# EAGLE design arduino_uno_pcb _with_lcd (EAGLE 6.1)
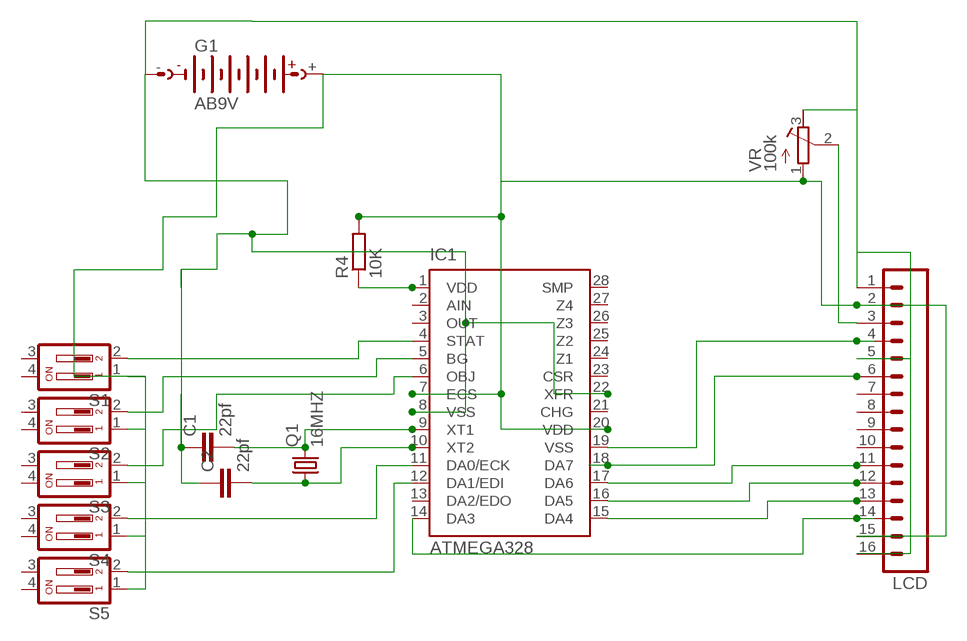
[diagram p0: schematic, sheet 1]

## Parts
C1  22pf  C2.5/2  [C2.5-2]
C2  22pf  C2.5/2  [C2.5-2]
G1  AB9V  [AB9V]
IC1  ATMEGA328  QT9701BD  [DIL28-3]
LCD  M16  [16P]
Q1  16MHZ  CRYSTALHC49S  [HC49/S]
R4  10K  R-EU_0207/10  [0207/10]
S1  DP02  [DP-02]
S2  DP02  [DP-02]
S3  DP02  [DP-02]
S4  DP02  [DP-02]
S5  DP02  [DP-02]
VR  100k  R-TRIMM64P  [RTRIM64P]

## Nets
N$1: C1.2 IC1.9(XT1) Q1.2
N$2: C2.2 IC1.10(XT2) Q1.1
N$3: G1.+ IC1.7(ECS) IC1.20(VDD) LCD.2 LCD.15 R4.2 S1.1 S2.1 S3.1 S4.1 S5.1 VR.1(E)
N$4: IC1.11(DA0/ECK) S4.2
N$5: IC1.4(STAT) S1.2
N$7: IC1.5(BG) S2.2
N$8: IC1.6(OBJ) S3.2
N$9: IC1.12(DA1/EDI) S5.2
N$22: LCD.3 VR.2(S)
N$23: IC1.19(VSS) LCD.4
N$24: IC1.18(DA7) LCD.6
N$25: IC1.17(DA6) LCD.11
N$26: IC1.16(DA5) LCD.12
N$27: IC1.15(DA4) LCD.13
N$28: C1.1 C2.1 G1.- IC1.8(VSS) IC1.22(XFR) LCD.1 LCD.5 LCD.16 VR.3(A)
N$29: IC1.14(DA3) LCD.14
N$31: IC1.1(VDD) R4.1
Unconnected: IC1.2(AIN) IC1.3(OUT) IC1.13(DA2/EDO) IC1.21(CHG) IC1.23(CSR) IC1.24(Z1) IC1.25(Z2) IC1.26(Z3) IC1.27(Z4) IC1.28(SMP) LCD.7 LCD.8 LCD.9 LCD.10 S1.3 S1.4 S2.3 S2.4 S3.3 S3.4 S4.3 S4.4 S5.3 S5.4

## Library data of the parts
C1 C2 = capacitor-wima:C: CAPACITOR naming: grid - package width
G1 = battery:AB9V: 9-V BATTERY CLIP
IC1 = quantum-research-group:QT9701B: Charge-Transfer Capacitance Sensor IC Source: http://data.qprox.com/downloads/datasheets/qt9701b.pdf; OC_FARNELL: unknown; OC_NEWARK: unknown
LCD = con-amp-quick:M16: AMP QUICK CONNECTOR; OC_FARNELL: unknown; OC_NEWARK: unknown
Q1 = crystal:CRYSTAL: CRYSTAL; OC_FARNELL: 1667008; OC_NEWARK: unknown
R4 = rcl:R-EU_: RESISTOR, European symbol
S1-S5 = switch-dil:DP02: DIL/CODE SWITCH; MPN: MCDP02; OC_FARNELL: 1255233; OC_NEWARK: 26M1095
VR = resistor:R-TRIMM: Trimm resistor

## Board
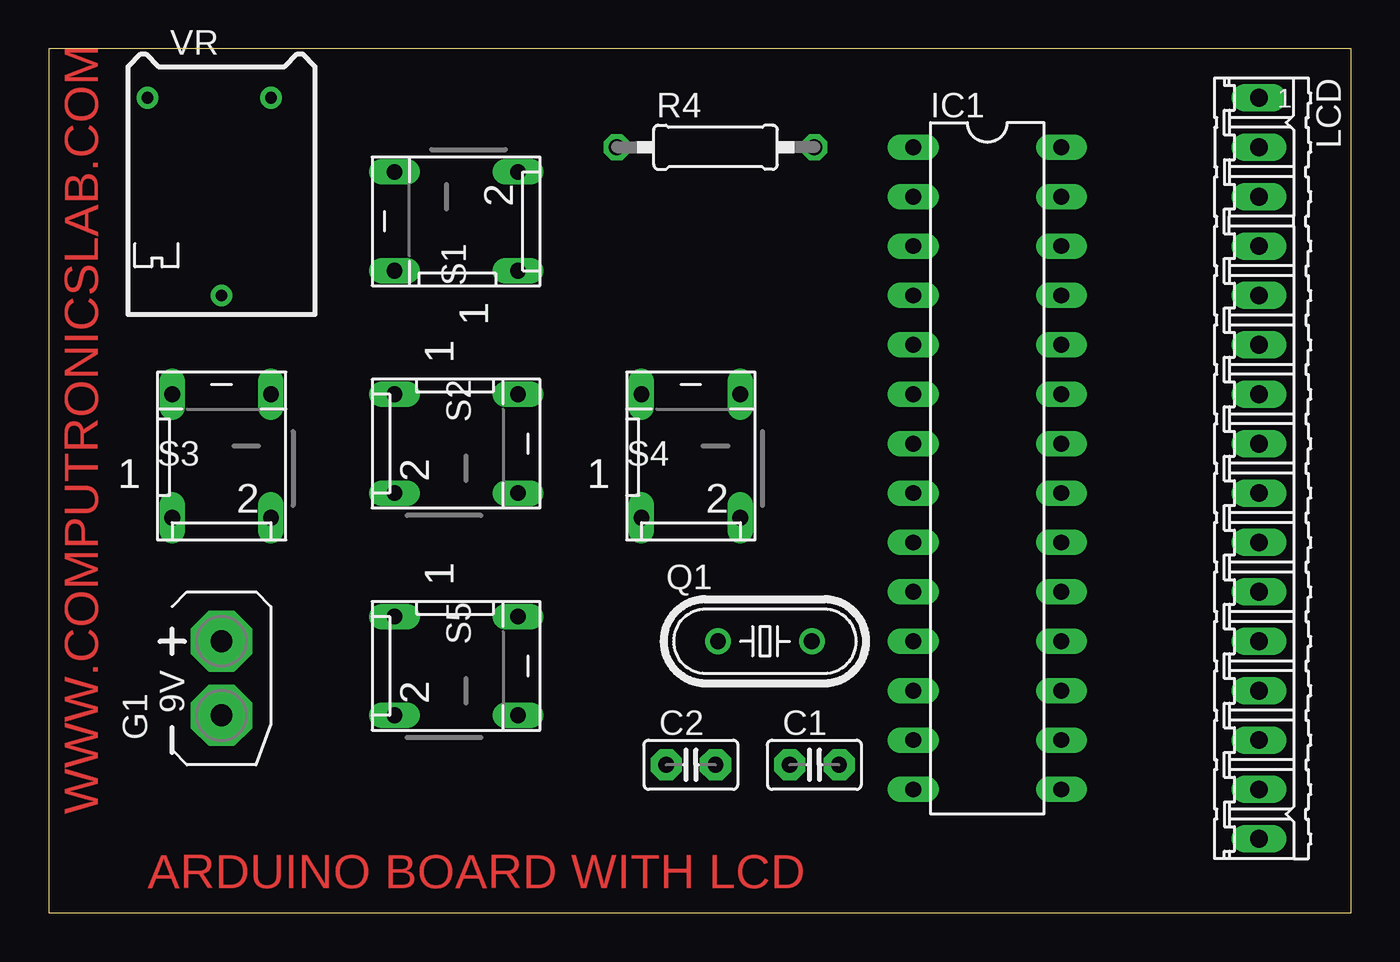
[diagram p1: board, top side]
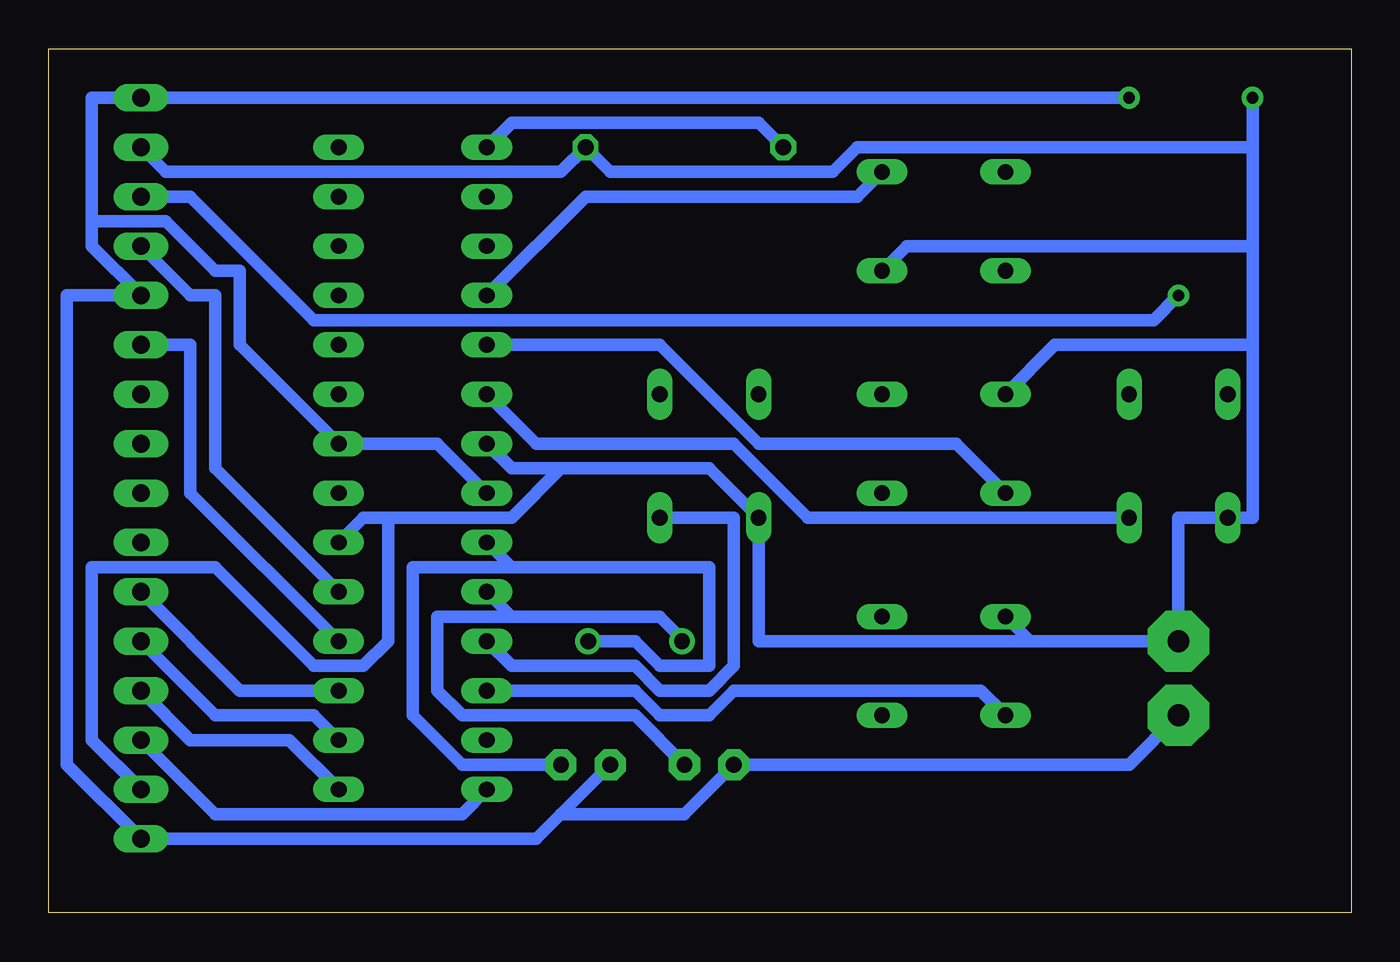
[diagram p2: board, bottom side, seen from below]

Size 66.98 x 44.44 mm. Coordinates in mm from the lower left corner, seen from the top.
Outline: 0,0 66.98,0 66.98,44.44 0,44.44 0,0
Copper layers (1*16): Top 0.035mm / dielectric 1.5mm / Bottom 0.035mm
Design rules: minimum track width 25mil, minimum drill 24mil, track to track 8mil, track to pad 8mil, pad to pad 8mil, via to via 8mil, smd to smd 8mil, copper to edge 40mil, drill to drill 8mil, minimum pad ring 10mil, minimum via ring 8mil, stop-mask expansion 4mil, vias tented up to drill 0mil, thermal gap 10mil

### Footprints (pad centres in the part's own frame; a part is rotated, then mirrored left to right if it is on the bottom)
C2.5-2 = drill 0.813 pad 1.6 octagon: 1 -1.27,0; 2 1.27,0
AB9V = drill 1.118 pad 3.15 octagon: + 0,2.54; - 0,-1.27
DIL28-3 = drill 0.813 long: 1 -16.51,-3.81; 2 -13.97,-3.81; 3 -11.43,-3.81; 4 -8.89,-3.81; 5 -6.35,-3.81; 6 -3.81,-3.81; 7 -1.27,-3.81; 8 1.27,-3.81; 9 3.81,-3.81; 10 6.35,-3.81; 11 8.89,-3.81; 12 11.43,-3.81; 13 13.97,-3.81; 14 16.51,-3.81; 15 16.51,3.81; 16 13.97,3.81; 17 11.43,3.81; 18 8.89,3.81; 19 6.35,3.81; 20 3.81,3.81; 21 1.27,3.81; 22 -1.27,3.81; 23 -3.81,3.81; 24 -6.35,3.81; 25 -8.89,3.81; 26 -11.43,3.81; 27 -13.97,3.81; 28 -16.51,3.81
16P = drill 0.914 long: 1 -19.05,0; 2 -16.51,0; 3 -13.97,0; 4 -11.43,0; 5 -8.89,0; 6 -6.35,0; 7 -3.81,0; 8 -1.27,0; 9 1.27,0; 10 3.81,0; 11 6.35,0; 12 8.89,0; 13 11.43,0; 14 13.97,0; 15 16.51,0; 16 19.05,0
HC49/S = drill 0.813: 1 -2.413,0; 2 2.413,0
0207/10 = drill 0.813 octagon: 1 -5.08,0; 2 5.08,0
DP-02 = drill 0.813 long: 1 -2.54,-2.54; 2 2.54,-2.54; 3 2.54,3.81; 4 -2.54,3.81
RTRIM64P = drill 0.61: 1 -2.54,-3.81; 2 7.62,0; 3 -2.54,2.54

### Placement (x,y rotation side)
C1  39.37,7.62 0 top
C2  33.02,7.62 0 top
G1  8.89,11.43 0 top
IC1  48.26,22.86 270 top
LCD  62.23,22.86 270 top
Q1  36.83,13.97 0 top
R4  34.29,39.37 0 top
S1  21.59,35.56 90 top
S2  20.32,24.13 270 top
S3  8.89,22.86 0 top
S4  33.02,22.86 0 top
S5  20.32,12.7 270 top
VR  8.89,39.37 270 top

### Tracks (layer width: path | path; a pad name or v marks a point on that pad's centre or on a via)
N$1
  Bottom 0.635: Q1.2 36.83,13.97 35.56,12.7 33.02,12.7 33.02,17.78 43.18,17.78 | Q1.2 39.37,13.97 Q1.2 | IC1.9 43.18,17.78 | C1.2 45.72,7.62 48.26,10.16 48.26,17.78 43.18,17.78
N$2
  Bottom 0.635: 43.18,15.24 35.56,15.24 34.29,13.97 Q1.1 | IC1.10 43.18,15.24 | C2.2 36.83,10.16 45.72,10.16 46.99,11.43 46.99,15.24 43.18,15.24
N$3
  Bottom 0.635: 16.51,13.97 S5.1 | 16.51,13.97 G1.+ 8.89,20.32 S3.1 5.08,20.32 5.08,29.21 | 16.51,13.97 30.48,13.97 S4.1 33.02,22.86 40.64,22.86 | IC1.7 43.18,22.86 40.64,22.86 | IC1.20 50.8,20.32 49.53,20.32 | 49.53,20.32 43.18,20.32 40.64,22.86 | LCD.15 64.77,8.89 64.77,17.78 58.42,17.78 53.34,12.7 50.8,12.7 49.53,13.97 49.53,20.32 | LCD.2 60.96,38.1 40.64,38.1 R4.2 38.1,38.1 26.67,38.1 25.4,39.37 5.08,39.37 | 5.08,29.21 5.08,34.29 | 5.08,34.29 5.08,39.37 | 5.08,39.37 VR.1 | S2.1 15.24,29.21 5.08,29.21 | S1.1 22.86,34.29 5.08,34.29
N$4
  Bottom 0.635: IC1.11 43.18,12.7 36.83,12.7 35.56,11.43 33.02,11.43 31.75,12.7 31.75,20.32 S4.2
N$5
  Bottom 0.635: IC1.4 39.37,36.83 25.4,36.83 S1.2
N$7
  Bottom 0.635: S2.2 20.32,24.13 30.48,24.13 35.56,29.21 IC1.5
N$8
  Bottom 0.635: S3.2 27.94,20.32 31.75,24.13 41.91,24.13 IC1.6
N$9
  Bottom 0.635: S5.2 19.05,11.43 31.75,11.43 33.02,10.16 35.56,10.16 36.83,11.43 IC1.12
N$22
  Bottom 0.635: VR.2 10.16,30.48 53.34,30.48 59.69,36.83 LCD.3
N$23
  Bottom 0.635: IC1.19 58.42,22.86 58.42,31.75 59.69,31.75 LCD.4
N$24
  Bottom 0.635: IC1.18 59.69,21.59 59.69,29.21 LCD.6
N$25
  Bottom 0.635: IC1.17 57.15,11.43 LCD.11
N$26
  Bottom 0.635: IC1.16 53.34,10.16 58.42,10.16 LCD.12
N$27
  Bottom 0.635: IC1.15 54.61,8.89 59.69,8.89 LCD.13
N$28
  Bottom 0.635: C1.1 40.64,5.08 | 40.64,5.08 41.91,3.81 LCD.16 66.04,7.62 66.04,31.75 LCD.5 64.77,34.29 64.77,35.56 | 40.64,5.08 34.29,5.08 C2.1 11.43,7.62 G1.- | IC1.8 46.99,24.13 IC1.22 57.15,29.21 57.15,33.02 58.42,33.02 60.96,35.56 64.77,35.56 | VR.3 LCD.1 64.77,41.91 64.77,35.56
N$29
  Bottom 0.635: IC1.14 45.72,5.08 58.42,5.08 LCD.14
N$31
  Bottom 0.635: R4.1 30.48,40.64 43.18,40.64 IC1.1

### Text on the board
Top: WWW.COMPUTRONICSLAB.COM | ARDUINO BOARD WITH LCD